# EAGLE design LEDController (EAGLE 6.5.0)
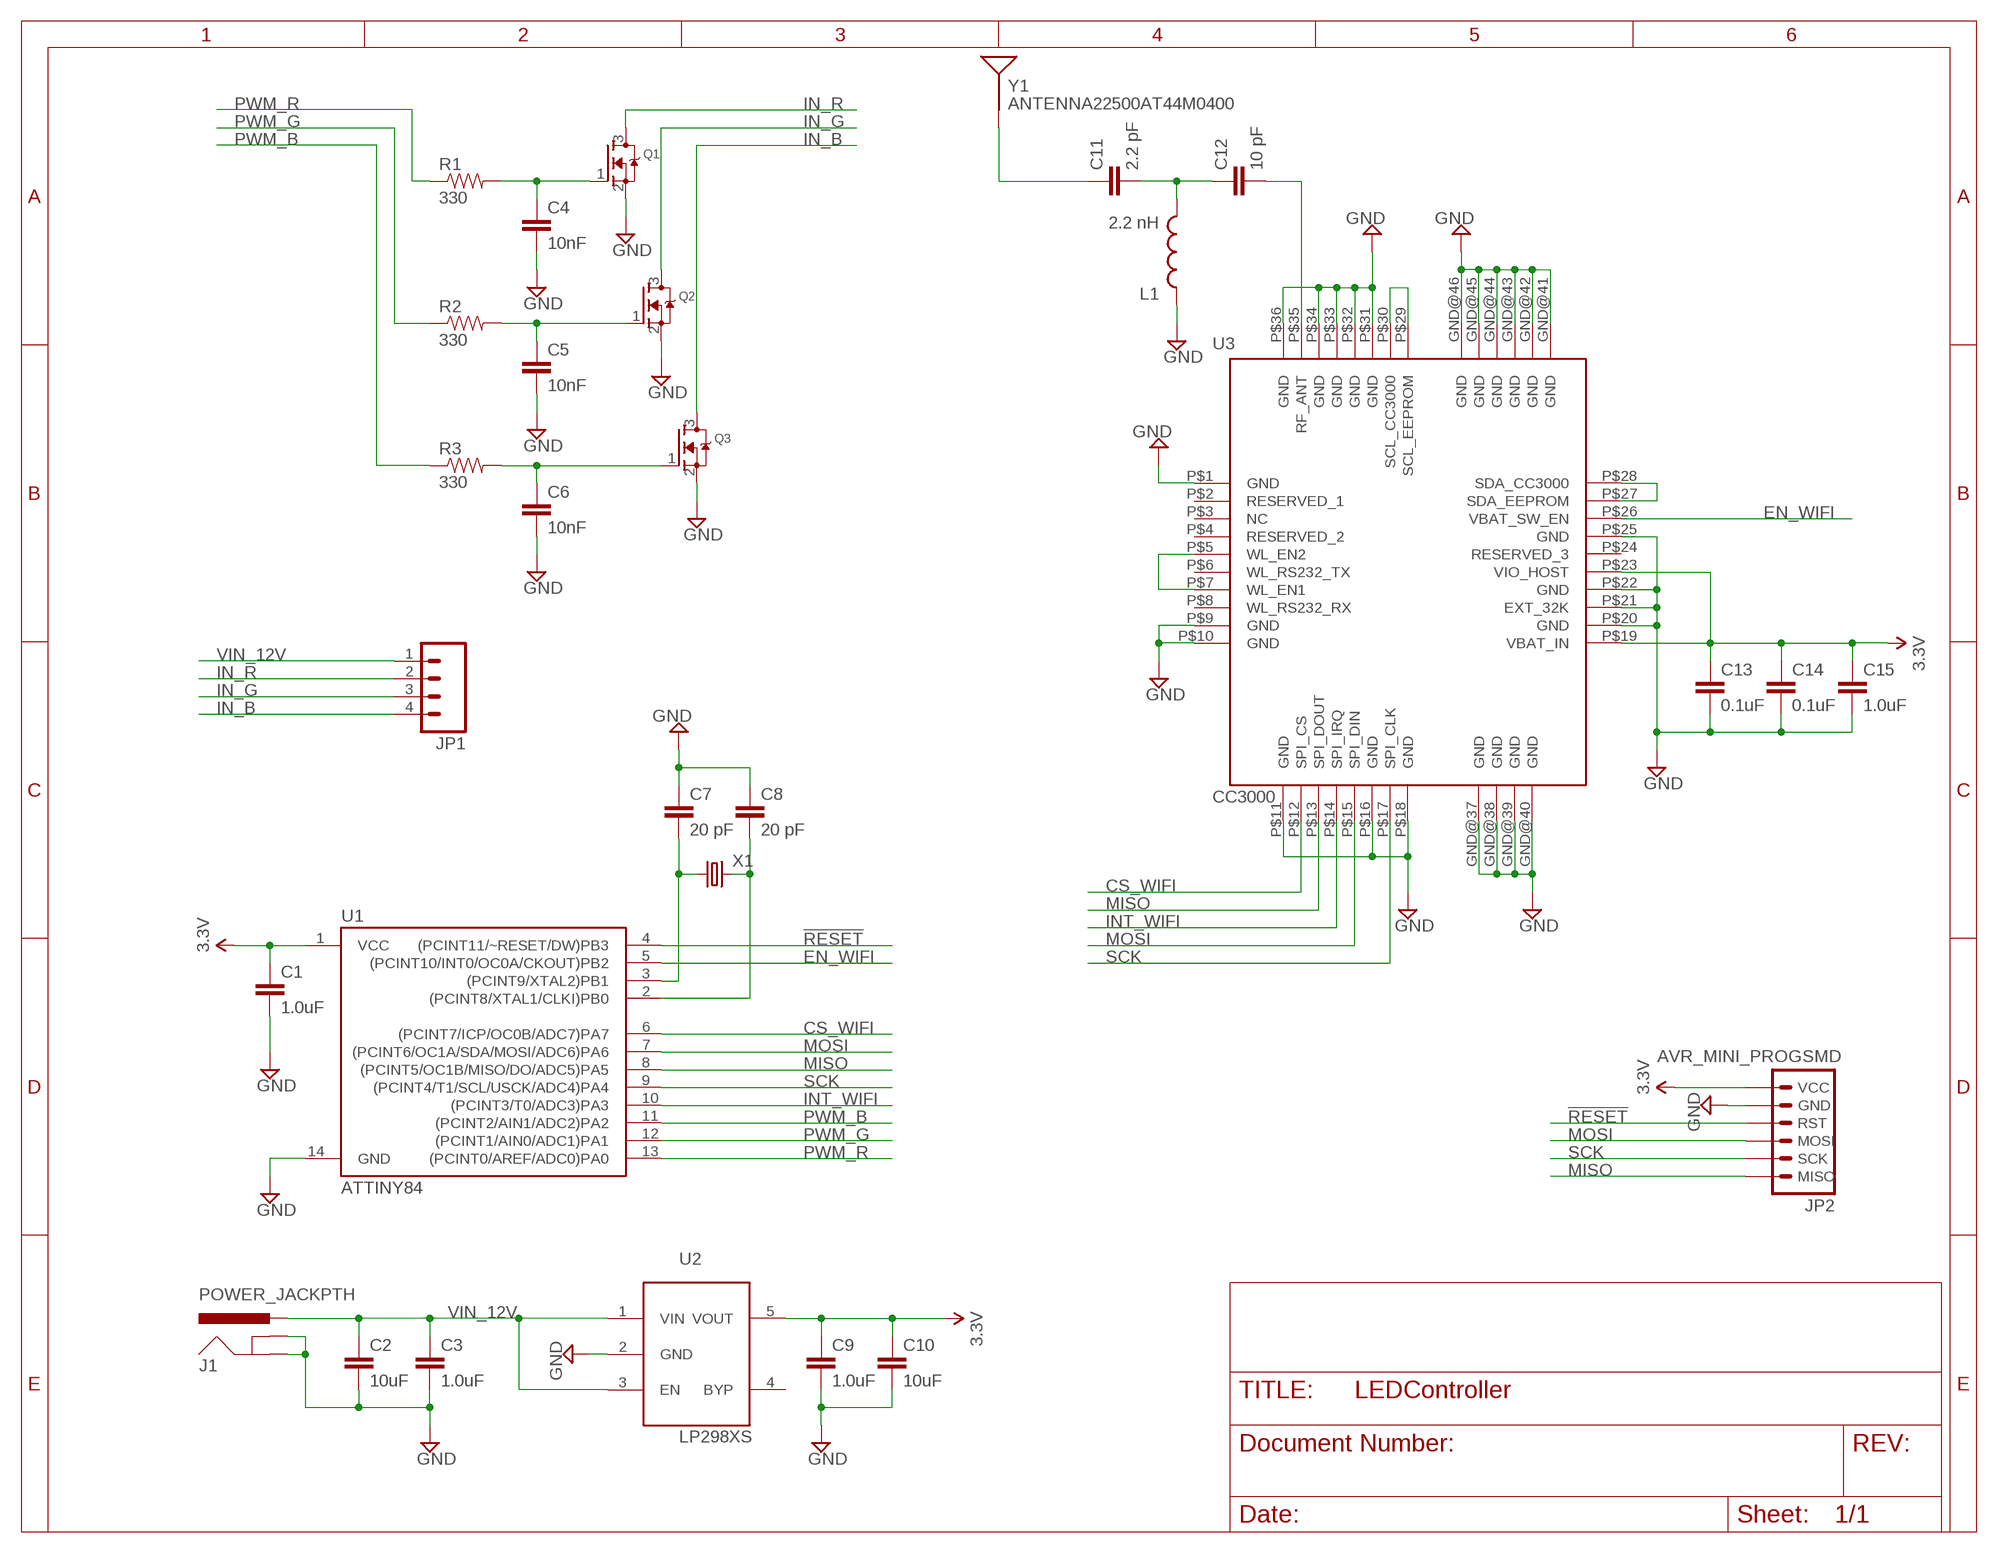
[diagram p0: schematic, sheet 1]

## Parts
C1  1.0uF  1.0UF-16V-10%(0603)  [0603-CAP]
C2  10uF  10UF-6.3V-20%(0603)  [0603-CAP]
C3  1.0uF  1.0UF-16V-10%(0603)  [0603-CAP]
C4  10nF  10NF/10000PF-50V-10%(0603)  [0603-CAP]
C5  10nF  10NF/10000PF-50V-10%(0603)  [0603-CAP]
C6  10nF  10NF/10000PF-50V-10%(0603)  [0603-CAP]
C7  20 pF  9.0PF-50V-10%(0603)  [0603-CAP]
C8  20 pF  9.0PF-50V-10%(0603)  [0603-CAP]
C9  1.0uF  1.0UF-16V-10%(0603)  [0603-CAP]
C10  10uF  10UF-6.3V-20%(0603)  [0603-CAP]
C11  2.2 pF  9.0PF-50V-10%(0603)  [0603-CAP]
C12  10 pF  9.0PF-50V-10%(0603)  [0603-CAP]
C13  0.1uF  0.1UF-25V-5%(0603)  [0603-CAP]
C14  0.1uF  0.1UF-25V-5%(0603)  [0603-CAP]
C15  1.0uF  1.0UF-16V-10%(0603)  [0603-CAP]
J1  POWER_JACKPTH  [POWER_JACK_PTH]
JP1  M04PTH  [1X04]
JP2  AVR_MINI_PROGSMD  [AVR_MINI_PROG]
L1  2.2 nH  INDUCTOR0603  [0603]
Q1  MOSFET-NREFLOW  [SOT23]
Q2  MOSFET-NREFLOW  [SOT23]
Q3  MOSFET-NREFLOW  [SOT23]
R1  330  330OHM1/10W1%(0603)  [0603-RES]
R2  330  330OHM1/10W1%(0603)  [0603-RES]
R3  330  330OHM1/10W1%(0603)  [0603-RES]
U1  ATTINY84  [SO14]
U2  LP298XS  [SOT23-5L]
U3  CC3000  [QFN-46_CC3000]
X1  CRYSTAL5X3  [CRYSTAL-SMD-5X3]
Y1  ANTENNA22500AT44M0400  [ANTENNA-CHIP_2500AT44M0400]

## Nets
3.3V: C1.1 C9.1 C10.1 C13.1 C14.1 C15.1 JP2.1(VCC) U1.1(VCC) U2.5(VOUT) U3.P$19(VBAT_IN) U3.P$23(VIO_HOST)
!RESET: JP2.3(RST) U1.4((PCINT11/~RESET/DW)PB3)
CS_WIFI: U1.6((PCINT7/ICP/OC0B/ADC7)PA7) U3.P$12(SPI_CS)
EN_WIFI: U1.5((PCINT10/INT0/OC0A/CKOUT)PB2) U3.P$26(VBAT_SW_EN)
GND: C1.2 C2.2 C3.2 C4.2 C5.2 C6.2 C7.1 C8.1 C9.2 C10.2 C13.2 C14.2 C15.2 J1.GND J1.GNDBREAK JP2.2(GND) L1.1 Q1.2(S) Q2.2(S) Q3.2(S) U1.14(GND) U2.2(GND) U3.GND@37(GND) U3.GND@38(GND) U3.GND@39(GND) U3.GND@40(GND) U3.GND@41(GND) U3.GND@42(GND) U3.GND@43(GND) U3.GND@44(GND) U3.GND@45(GND) U3.GND@46(GND) U3.P$1(GND) U3.P$9(GND) U3.P$10(GND) U3.P$11(GND) U3.P$16(GND) U3.P$18(GND) U3.P$20(GND) U3.P$21(EXT_32K) U3.P$22(GND) U3.P$25(GND) U3.P$31(GND) U3.P$32(GND) U3.P$33(GND) U3.P$34(GND) U3.P$36(GND)
IN_B: JP1.4 Q3.3(D)
IN_G: JP1.3 Q2.3(D)
IN_R: JP1.2 Q1.3(D)
INT_WIFI: U1.10((PCINT3/T0/ADC3)PA3) U3.P$14(SPI_IRQ)
MISO: JP2.6(MISO) U1.8((PCINT5/OC1B/MISO/DO/ADC5)PA5) U3.P$13(SPI_DOUT)
MOSI: JP2.4(MOSI) U1.7((PCINT6/OC1A/SDA/MOSI/ADC6)PA6) U3.P$15(SPI_DIN)
N$2: U3.P$27(SDA_EEPROM) U3.P$28(SDA_CC3000)
N$3: U3.P$29(SCL_EEPROM) U3.P$30(SCL_CC3000)
N$4: C6.1 Q3.1(G) R3.2
N$5: C5.1 Q2.1(G) R2.2
N$6: C4.1 Q1.1(G) R1.2
N$8: U3.P$5(WL_EN2) U3.P$7(WL_EN1)
N$10: C11.2 C12.1 L1.2
N$11: C11.1 Y1.FEED(SIGNAL)
N$12: C7.2 U1.3((PCINT9/XTAL2)PB1) X1.1
N$13: C8.2 U1.2((PCINT8/XTAL1/CLKI)PB0) X1.3
PWM_B: R3.1 U1.11((PCINT2/AIN1/ADC2)PA2)
PWM_G: R2.1 U1.12((PCINT1/AIN0/ADC1)PA1)
PWM_R: R1.1 U1.13((PCINT0/AREF/ADC0)PA0)
RF_ANT: C12.2 U3.P$35(RF_ANT)
SCK: JP2.5(SCK) U1.9((PCINT4/T1/SCL/USCK/ADC4)PA4) U3.P$17(SPI_CLK)
VIN_12V: C2.1 C3.1 J1.PWR JP1.1 U2.1(VIN) U2.3(EN)
Unconnected: U2.4(BYP) U3.P$2(RESERVED_1) U3.P$3(NC) U3.P$4(RESERVED_2) U3.P$6(WL_RS232_TX) U3.P$8(WL_RS232_RX) U3.P$24(RESERVED_3)

## Library data of the parts
C1 C3 C9 C15 = SparkFun-Capacitors:1.0UF-16V-10%(0603): CAP-00868; PROD_ID: CAP-00868
C2 C10 = SparkFun-Capacitors:10UF-6.3V-20%(0603): CAP-11015; PROD_ID: CAP-11015
C4-C6 = SparkFun-Capacitors:10NF/10000PF-50V-10%(0603): CAP-00867; PROD_ID: CAP-00867
C7 C8 C11 C12 = SparkFun-Capacitors:9.0PF-50V-10%(0603): CAP-09341; PROD_ID: CAP-09341; VALUE: 9.0pF
C13 C14 = SparkFun-Capacitors:0.1UF-25V-5%(0603): CAP-08604; PROD_ID: CAP-08604
J1 = SparkFun-Connectors:POWER_JACK: Power Jack This is the standard 5.5mm barrel jack for power. The PTH is the most common, proven, reliable, footprint. The Slot footprint only works if the mill layer is transmitted to the PCB fab house so be warned. Mating wall wart : TOL-00298 (and others); PROD_ID: PRT-00119
JP1 = SparkFun-Connectors:M04: Header 4 Standard 4-pin 0.1" header. Use with straight break away headers (SKU : PRT-00116), right angle break away headers (PRT-00553), swiss pins (PRT-00743), machine pins (PRT-00117), and female headers (PRT-00115). Molex polarized connector foot print use with SKU : PRT-08231 with associated crimp pins and housings. 1MM SMD Version SKU: PRT-10208
JP2 = SparkFun-Connectors:AVR_MINI_PROG: AVR ISP 6-pin inline header
L1 = SparkFun-Passives:INDUCTOR: Inductors Basic Inductor/Choke - 0603 and 1206. Footprints are not proven and vary greatly between part numbers. SRN6045- 33uH, 20% 1.4A SDR0403-560KL - 56uH, 10%, 500mA RMS/740mA peak
Q1-Q3 = adafruit:MOSFET-N: N-Channel Mosfet 2N7002E - 60V 260mA SOT23 [Digikey: 2N7002ET1GOSTR-ND] - REEL BSH103 - 30V 850mA SOT23 [Digikey: 568-5013-1-ND]
R1-R3 = SparkFun-Resistors:330OHM1/10W1%(0603): RES-00818; PROD_ID: RES-00818
U1 = SparkFun-DigitalIC:ATTINY84: Atmel 14-pin 2/4/8kB flash uC
U2 = adafruit:LP298X
U3 = SparkFun-RF:CC3000: TI CC3000 WiFi Module
X1 = SparkFun-FreqCtrl:CRYSTAL: Various standard crystals. Proven footprints. Spark Fun Electronics SKU : COM-00534
Y1 = SparkFun-RF:ANTENNA2: Chip antenna Single endded antenna. Common with smaller chip antennas. CHIP4 package is the GPS Chip Antenna SKU: GPS-08418. CHIP5 package is 2.4GHz chip antenna SKU: WRL-00144.

## Board
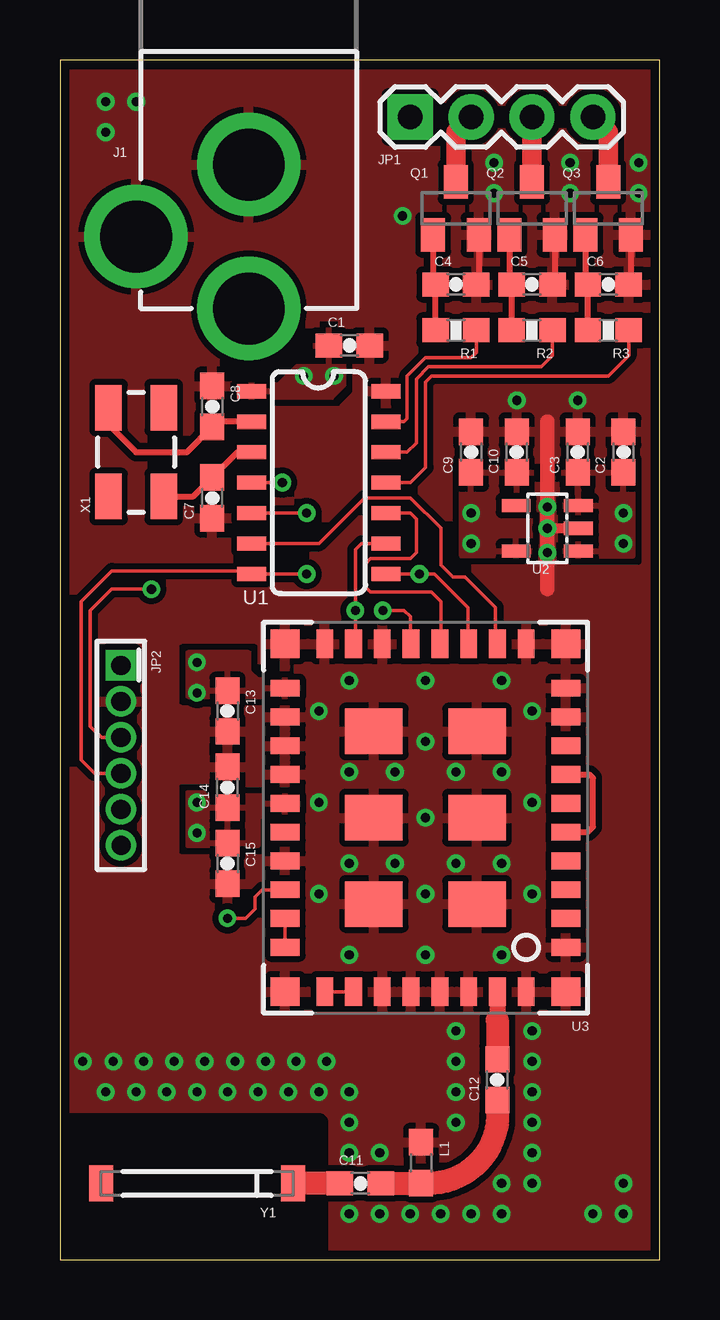
[diagram p1: board, top side]
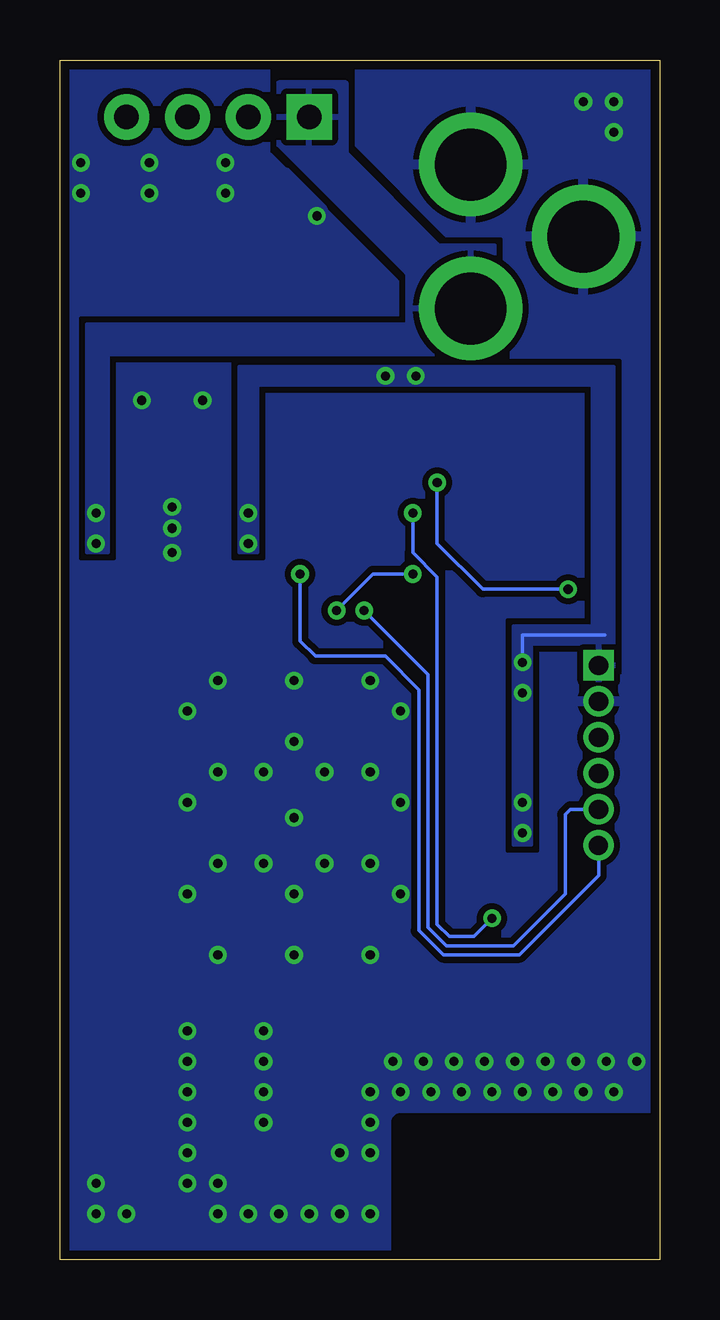
[diagram p2: board, bottom side, seen from below]

Size 25 x 50 mm. Coordinates in mm from the lower left corner, seen from the top.
Outline: 0,0 25,0 25,50 0,50 0,0
Copper layers (1*16): Top 0.0356mm / dielectric 1.5011mm / Bottom 0.0356mm
Design rules "LaenPCBOrder": minimum track width 6mil, minimum drill 13mil, track to track 6mil, track to pad 6mil, pad to pad 6mil, via to via 6mil, smd to smd 6mil, copper to edge 15mil, drill to drill 6mil, minimum pad ring 7mil, minimum via ring 7mil, stop-mask expansion 3mil, vias tented up to drill 0mil, thermal gap 10mil
tRestrict: area 0,0 to 10.8,5.7
bRestrict: area 0,0 to 10.8,5.7
vRestrict: area 0,0 to 10.8,5.7

### Footprints (pad centres in the part's own frame; a part is rotated, then mirrored left to right if it is on the bottom)
0603-CAP = smd 1.1 x 1: 1 -0.85,0; 2 0.85,0
POWER_JACK_PTH = drill 2.997 pad 4.318: GND 0,7.7; GNDBREAK 4.7,10.7; PWR 0,13.7
1X04 = drill 1.016 pad 1.88 square: 1 0,0 | drill 1.016 pad 1.88: 2 2.54,0; 3 5.08,0; 4 7.62,0
AVR_MINI_PROG = drill 0.8 pad 1.27 square: 1 0,0 | drill 0.8 pad 1.27: 2 1.5,0; 3 3,0; 4 4.5,0; 5 6,0; 6 7.5,0.01
0603 = smd 1.1 x 1: 1 -0.85,0; 2 0.85,0
SOT23 = smd 1 x 1.4: 1 -0.95,-1.1; 2 0.95,-1.1; 3 0,1.1
0603-RES = smd 1.1 x 1: 1 -0.85,0; 2 0.85,0
SO14 = smd 0.6 x 1.2: 1 -3.81,-2.8; 2 -2.54,-2.8; 3 -1.27,-2.8; 4 0,-2.8; 5 1.27,-2.8; 6 2.54,-2.8; 7 3.81,-2.8; 8 3.81,2.8; 9 2.54,2.8; 10 1.27,2.8; 11 0,2.8; 12 -1.27,2.8; 13 -2.54,2.8; 14 -3.81,2.8
SOT23-5L = smd 0.55 x 1.2: 1 -0.95,-1.3; 2 0,-1.3; 3 0.95,-1.3; 4 0.95,1.3; 5 -0.95,1.3
QFN-46_CC3000 = smd 2.4 x 1.9: GND@37 -2.15,3.6; GND@38 -2.15,0; GND@39 -2.15,-3.6; GND@40 2.15,3.6; GND@41 2.15,0; GND@42 2.15,-3.6 | smd 1.2 x 1.2: GND@43 -5.85,7.25; GND@44 -5.85,-7.25; GND@45 5.85,-7.25; GND@46 5.85,7.25 | smd 1.2 x 0.7: P$1 -5.85,5.4; P$2 -5.85,4.2; P$3 -5.85,3; P$4 -5.85,1.8; P$5 -5.85,0.6; P$6 -5.85,-0.6; P$7 -5.85,-1.8; P$8 -5.85,-3; P$9 -5.85,-4.2; P$10 -5.85,-5.4; P$19 5.85,-5.4; P$20 5.85,-4.2; P$21 5.85,-3; P$22 5.85,-1.8; P$23 5.85,-0.6; P$24 5.85,0.6; P$25 5.85,1.8; P$26 5.85,3; P$27 5.85,4.2; P$28 5.85,5.4 | smd 0.7 x 1.2: P$11 -4.2,-7.25; P$12 -3,-7.25; P$13 -1.8,-7.25; P$14 -0.6,-7.25; P$15 0.6,-7.25; P$16 1.8,-7.25; P$17 3,-7.25; P$18 4.2,-7.25; P$29 4.2,7.25; P$30 3,7.25; P$31 1.8,7.25; P$32 0.6,7.25; P$33 -0.6,7.25; P$34 -1.8,7.25; P$35 -3,7.25; P$36 -4.2,7.25
CRYSTAL-SMD-5X3 = smd 1.9 x 1.1: 1 -1.85,-1.15; 2 1.85,-1.15; 3 1.85,1.15; 4 -1.85,1.15
ANTENNA-CHIP_2500AT44M0400 = smd 1 x 1.5: FEED -4,0; NC 4,0

### Placement (x,y rotation side)
C1  12.06,38.1 0 top
C2  23.5,33.66 90 top
C3  21.59,33.66 90 top
C4  16.51,40.64 0 top
C5  19.68,40.64 0 top
C6  22.86,40.64 0 top
C7  6.35,31.75 90 top
C8  6.35,35.56 270 top
C9  17.14,33.66 90 top
C10  19.05,33.66 90 top
C11  12.52,3.17 0 top
C12  18.24,7.49 90 top
C13  6.99,22.86 270 top
C14  6.99,19.68 90 top
C15  6.99,16.51 270 top
J1  7.87,53.34 180 top
JP1  14.61,47.62 0 top
JP2  2.54,24.77 270 top
L1  15.06,4.04 270 top
Q1  16.51,43.81 0 top
Q2  19.68,43.81 0 top
Q3  22.86,43.81 0 top
R1  16.51,38.73 180 top
R2  19.68,38.73 180 top
R3  22.86,38.73 180 top
U1  10.79,32.38 270 top
U2  20.32,30.48 90 top
U3  15.24,18.41 180 top
X1  3.17,33.66 90 top
Y1  5.71,3.17 180 top

### Tracks (layer width: path | path; a pad name or v marks a point on that pad's centre or on a via)
3.3V  (via drill 0.38)
  Bottom 0.152: 2.29,26.04 5.71,26.04 v5.71,24.89
  other vias: 17.14,31.11 17.14,29.84 5.71,23.62 5.71,19.05 5.71,17.78 10.16,36.83 11.43,36.83
  pour Top (isolate 0.254): 20.07,33.02 20.07,29.34 16.76,29.34 16.76,33.02
  pour Top: 5.33,25.27 5.33,23.5 9.91,23.5 9.91,24.13 8.26,24.13 7.87,24.51 7.87,25.27
  pour Top: 5.33,19.43 5.33,17.4 5.33,17.27 8.26,17.27 8.26,18.41 8.51,18.67 9.91,18.67 9.91,19.3 6.1,19.3 5.97,19.43
  pour Bottom: 5.33,25.78 5.33,17.27 6.1,17.27 6.1,25.78
  pour Top: 11.81,38.73 11.81,36.45 11.3,35.94 7.49,35.94 7.49,36.45 9.14,36.45 9.91,37.21 10.67,37.21 10.67,38.73
  pour Bottom: 16.76,31.5 16.76,29.46 17.53,29.46 17.53,31.5
  pour Bottom: 1.91,37.21 1.91,36.45 16.76,36.45 16.76,31.5 17.53,31.5 17.53,37.21
  pour Bottom: 1.91,25.65 6.1,25.65 6.1,26.42 1.91,26.42
  pour Bottom: 1.91,24.13 1.91,36.83 2.79,36.83 2.79,24.13
!RESET  (via drill 0.38)
  Top 0.152: JP2.3 1.73,21.77 1.27,22.23 1.27,27.05 2.16,27.94 v3.81,27.94 | v9.27,32.38 U1.4
  Bottom 0.152: v3.81,27.94 7.37,27.94 9.27,29.84 v9.27,32.38
CS_WIFI
  Top 0.152: U3.P$12 18.16,25.66 18.16,27.18 16.89,28.45 16.38,28.45 15.88,28.96 15.88,30.48 14.61,31.75 12.7,31.75 10.79,29.84 U1.6
EN_WIFI  (via drill 0.38)
  Top 0.152: U1.5 v10.29,31.11 | v6.99,14.22 7.75,14.22 8.13,14.61 8.13,15.11 8.43,15.41 U3.P$26
  Bottom 0.152: v10.29,31.11 10.29,29.46 9.27,28.45 9.27,13.97 8.76,13.46 7.75,13.46 v6.99,14.22
GND  (via drill 0.38)
  Top 0.254: Q1.2 17.46,40.74 | Q2.2 20.64,40.74 | Q3.2 23.81,40.74
  Top 0.406: 17.46,40.74 C4.2 | 20.64,40.74 C5.2 | 23.81,40.74 C6.2 | v20.32,30.48 U2.2
  Top 0.61: 20.32,34.92 20.32,27.94
  other vias: 1.91,6.99 3.17,6.99 4.45,6.99 5.71,6.99 6.99,6.99 8.26,6.99 9.53,6.99 10.79,6.99 12.06,6.99 12.06,5.71 12.06,4.45 16.51,9.53 16.51,8.26 16.51,6.99 16.51,5.71 13.34,4.45 12.06,1.91 13.34,1.91 14.61,1.91 15.88,1.91 17.14,1.91 18.41,3.17 19.68,4.45 19.68,5.71 19.68,6.99 19.68,8.26 19.68,9.53 10.79,22.86 12.06,24.13 15.24,24.13 18.41,24.13 19.68,22.86 15.24,21.59 13.97,20.32 16.51,20.32 15.24,18.41 10.79,19.05 12.06,20.32 12.06,16.51 10.79,15.24 13.97,16.51 15.24,15.24 16.51,16.51 18.41,16.51 19.68,15.24 18.41,12.7 15.24,12.7 12.06,12.7 18.41,20.32 19.68,19.05 18.1,45.72 21.27,45.72 24.13,45.72 14.29,43.5 19.05,35.81 21.59,35.81 1.91,48.26 3.17,48.26 1.91,46.99 22.23,1.91 23.5,1.91 23.5,3.17 18.1,44.45 21.27,44.45 24.13,44.45 0.95,8.26 2.22,8.26 3.49,8.26 4.76,8.26 6.03,8.26 7.3,8.26 8.57,8.26 9.84,8.26 11.11,8.26 19.68,3.17 18.41,1.91 20.32,31.37 20.32,29.46
  pour Bottom (isolate 0.254, rank 6): -1.27,50.8 25.4,50.8 25.4,-1.27 -1.27,-1.27
  pour Top (isolate 0.254, rank 6): -2.54,52.07 26.67,52.07 26.67,-2.54 -2.54,-2.54
  pour Bottom: 13.97,43.81 13.97,43.18 14.61,43.18 16.19,44.77 24.13,44.77 24.13,45.4 15.56,45.4
IN_B
  Top 0.813: Q3.3 22.86,46.99 JP1.4
IN_G
  Top 0.813: Q2.3 JP1.3
IN_R
  Top 0.813: Q1.3 16.51,46.99 JP1.2
INT_WIFI
  Top 0.152: U3.P$14 15.88,25.66 15.88,27.43 15.49,27.81 12.95,27.81 12.7,28.07 12.7,28.96 12.95,29.21 14.61,29.21 14.86,29.46 14.86,30.86 14.61,31.11 U1.10
MISO  (via drill 0.38)
  Top 0.152: U3.P$13 17.02,25.66 17.02,27.18 15.62,28.57 v14.99,28.57 U1.8
  Bottom 0.152: v14.99,28.57 14.99,25.78 14.35,25.15 11.43,25.15 10.03,23.75 10.03,13.72 9.02,12.7 5.84,12.7 2.54,16 2.54,17.25 JP2.6
MOSI  (via drill 0.38)
  Top 0.152: U3.P$15 14.61,25.66 14.61,26.8 14.35,27.05 v13.46,27.05 | v10.29,28.57 U1.7 7.87,28.7 2.16,28.7 0.89,27.43 0.89,20.83 1.45,20.27 JP2.4
  Bottom 0.152: v10.29,28.57 11.94,28.57 v13.46,27.05
N$2
  Top 0.152: U3.P$27 U3.P$28
N$3
  Top 0.152: U3.P$29 U3.P$30
N$4
  Top 0.254: Q3.1 21.91,40.74 | R3.2 C6.1
  Top 0.406: 21.91,40.74 C6.1
N$5
  Top 0.254: Q2.1 18.73,40.74 | R2.2 C5.1
  Top 0.406: 18.73,40.74 C5.1
N$6
  Top 0.254: Q1.1 15.56,40.74 | R1.2 C4.1
  Top 0.406: 15.56,40.74 C4.1
N$8
  Top 0.254: U3.P$5 22.01,17.82 22.23,18.03 22.23,20.07 22.08,20.21 U3.P$7
N$10
  Top 0.965: C12.1 18.24,5.73 arc-90 L1.2 arc-90 15.05,3.17 C11.2
N$11
  Top 0.965: C11.1 Y1.FEED
N$12
  Top 0.254: U1.3 7.41,33.66 C7.2 5.55,31.8 X1.1
N$13
  Top 0.254: U1.2 6.57,34.92 C8.2 5.29,33.66 3.17,33.66 2.02,34.8 X1.3
PWM_B
  Top 0.152: R3.1 23.71,37.68 22.86,36.83 15.49,36.83 15.24,36.58 15.24,33.02 14.61,32.38 U1.11
PWM_G
  Top 0.152: R2.1 20.54,37.68 20.07,37.21 15.37,37.21 14.86,36.7 14.86,34.04 14.48,33.66 U1.12
PWM_R
  Top 0.152: R1.1 17.36,37.81 17.14,37.59 15.24,37.59 14.48,36.83 14.48,35.05 14.35,34.92 U1.13
RF_ANT
  Top 0.61: U3.P$35
  Top 0.66: U3.P$35 18.24,9.98
  Top 0.965: 18.24,9.98 C12.2
SCK  (via drill 0.38)
  Top 0.152: U3.P$17 12.32,25.66 v12.32,27.05 12.32,29.59 12.57,29.84 U1.9
  Bottom 0.152: JP2.5 3.71,18.77 3.94,18.54 3.94,15.24 6.1,13.08 8.89,13.08 9.65,13.84 9.65,24.38 v12.32,27.05
VIN_12V  (via drill 0.38)
  other vias: 23.5,31.11 23.5,29.84
  pour Top (isolate 0.254): 20.7,33.02 20.7,29.34 23.88,29.34 23.88,33.02
  pour Bottom: 23.88,31.5 23.88,29.46 22.99,29.46 22.99,31.5
  pour Bottom: 22.99,31.5 22.99,37.72 6.73,37.72 6.73,38.35 6.86,40.51 6.86,42.29 10.54,42.29 10.54,38.99 23.88,38.99 23.88,31.5
  pour Bottom: 13.08,49.02 15.88,49.02 15.88,46.48 10.54,41.15 10.41,41.4 9.27,42.29 13.08,46.1

### Text on the board
tPlace: JP2